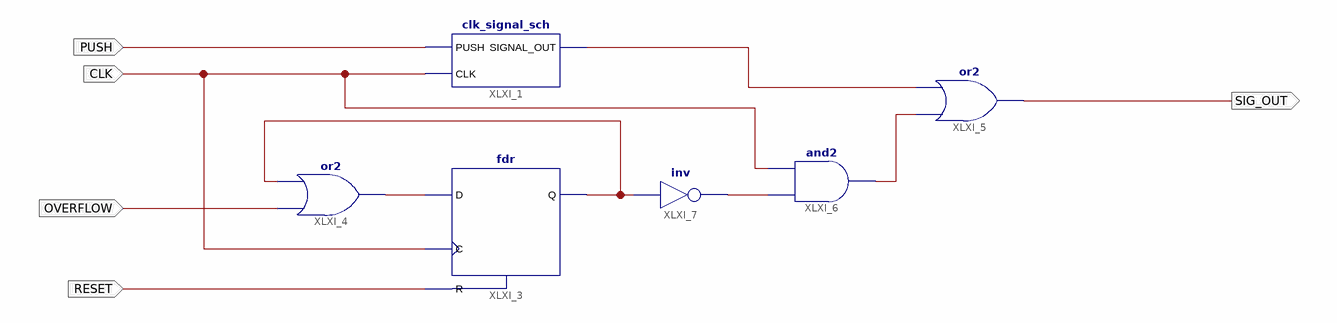
[diagram p0: schematic sheet 1]
// Xilinx ISE schematic BypassClk.sch (spartan3e) as structural Verilog: 6 symbols, 5 ports
module BypassClk (
  input  OVERFLOW,
  input  RESET,
  input  CLK,
  input  PUSH,
  output SIG_OUT
);

  wire XLXN_1, XLXN_3, XLXN_8, XLXN_11, XLXN_12;

  clk_signal_sch XLXI_1 (.PUSH(PUSH), .CLK(CLK), .SIGNAL_OUT(XLXN_12));
  fdr XLXI_3 (.C(CLK), .D(XLXN_1), .R(RESET), .Q(XLXN_3));
  or XLXI_4 (XLXN_1, OVERFLOW, XLXN_3);
  or XLXI_5 (SIG_OUT, XLXN_11, XLXN_12);
  and XLXI_6 (XLXN_11, XLXN_8, CLK);
  not XLXI_7 (XLXN_8, XLXN_3);
endmodule
